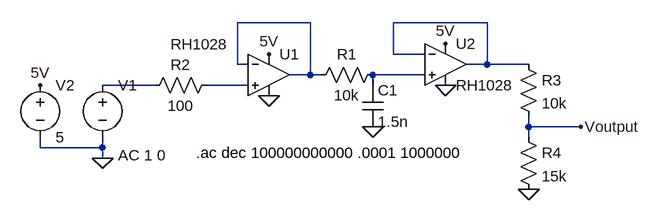
[diagram p0: schematic RCFilter.asc]
RCFilter.asc, the LTspice schematic file:
Version 4
SHEET 1 880 680
WIRE 128 -48 16 -48
WIRE 400 -48 256 -48
WIRE 256 0 256 -48
WIRE 304 0 256 0
WIRE 16 16 16 -48
WIRE 32 16 16 16
WIRE 400 16 400 -48
WIRE 400 16 368 16
WIRE 464 16 400 16
WIRE 128 32 128 -48
WIRE 128 32 96 32
WIRE 144 32 128 32
WIRE 304 32 224 32
WIRE -112 48 -192 48
WIRE 32 48 -32 48
WIRE 224 48 224 32
WIRE 464 112 464 96
WIRE 544 112 464 112
WIRE 464 128 464 112
WIRE -288 144 -288 128
WIRE -192 144 -192 128
WIRE -192 144 -288 144
WIRE -192 160 -192 144
FLAG 224 112 0
FLAG -192 160 0
FLAG 544 112 Voutput
FLAG -288 48 5V
FLAG 64 0 5V
FLAG 336 -16 5V
FLAG 64 64 0
FLAG 336 48 0
FLAG 464 208 0
SYMBOL res 240 16 R90
WINDOW 0 0 56 VBottom 2
WINDOW 3 32 56 VTop 2
SYMATTR InstName R1
SYMATTR Value 10k
SYMBOL cap 208 48 R0
SYMATTR InstName C1
SYMATTR Value 1.5n
SYMATTR SpiceLine V=100 Irms=0 Rser=0 Lser=0 Rpar=0 Cpar=0
SYMBOL voltage -192 32 R0
WINDOW 123 24 124 Left 2
WINDOW 39 0 0 Left 0
SYMATTR InstName V1
SYMATTR Value ""
SYMATTR Value2 AC 1 0
SYMBOL OpAmps\\RH1028 64 -32 R0
WINDOW 3 -151 17 Left 2
SYMATTR InstName U1
SYMBOL OpAmps\\RH1028 336 -48 R0
SYMATTR InstName U2
SYMBOL res -16 32 R90
WINDOW 0 0 56 VBottom 2
WINDOW 3 32 56 VTop 2
SYMATTR InstName R2
SYMATTR Value 100
SYMBOL voltage -288 32 R0
WINDOW 123 0 0 Left 0
WINDOW 39 0 0 Left 0
SYMATTR InstName V2
SYMATTR Value 5
SYMBOL res 448 0 R0
SYMATTR InstName R3
SYMATTR Value 10k
SYMBOL res 448 112 R0
SYMATTR InstName R4
SYMATTR Value 15k
TEXT -48 152 Left 2 !.ac dec 100000000000 .0001 1000000

The netlist it stands for:
* RCFilter.asc
R1 N003 N001 10k
C1 N003 0 1.5n V=100 Irms=0 Rser=0 Lser=0 Rpar=0 Cpar=0
V1 N004 0 AC 1 0
XU1 N005 N001 5V 0 N001 RH1028  ; pins In+ In- V+ V- OUT
XU2 N003 N002 5V 0 N002 RH1028  ; pins In+ In- V+ V- OUT
R2 N005 N004 100
V2 5V 0 5
R3 N002 Voutput 10k
R4 Voutput 0 15k
.ac dec 100000000000 .0001 1000000
.backanno
.end